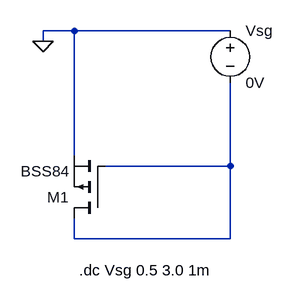
[diagram p0: schematic Question 3.asc]
Question 3.asc, the LTspice schematic file:
Version 4.1
SHEET 1 880 680
WIRE 48 16 0 16
WIRE 288 16 48 16
WIRE 0 32 0 16
WIRE 48 208 48 16
WIRE 288 224 288 96
WIRE 288 224 96 224
WIRE 48 336 48 304
WIRE 288 336 288 224
WIRE 288 336 48 336
FLAG 0 32 0
SYMBOL voltage 288 0 R0
SYMATTR InstName Vsg
SYMATTR Value 0V
SYMBOL pmos 96 304 R180
SYMATTR InstName M1
SYMATTR Value BSS84
TEXT 56 384 Left 2 !.dc Vsg 0.5 3.0 1m

The netlist it stands for:
* Question 3.asc
Vsg 0 N001 0V
M1 N001 N001 0 0 BSS84
.model NMOS NMOS
.model PMOS PMOS
.lib standard.mos
.dc Vsg 0.5 3.0 1m
.backanno
.end